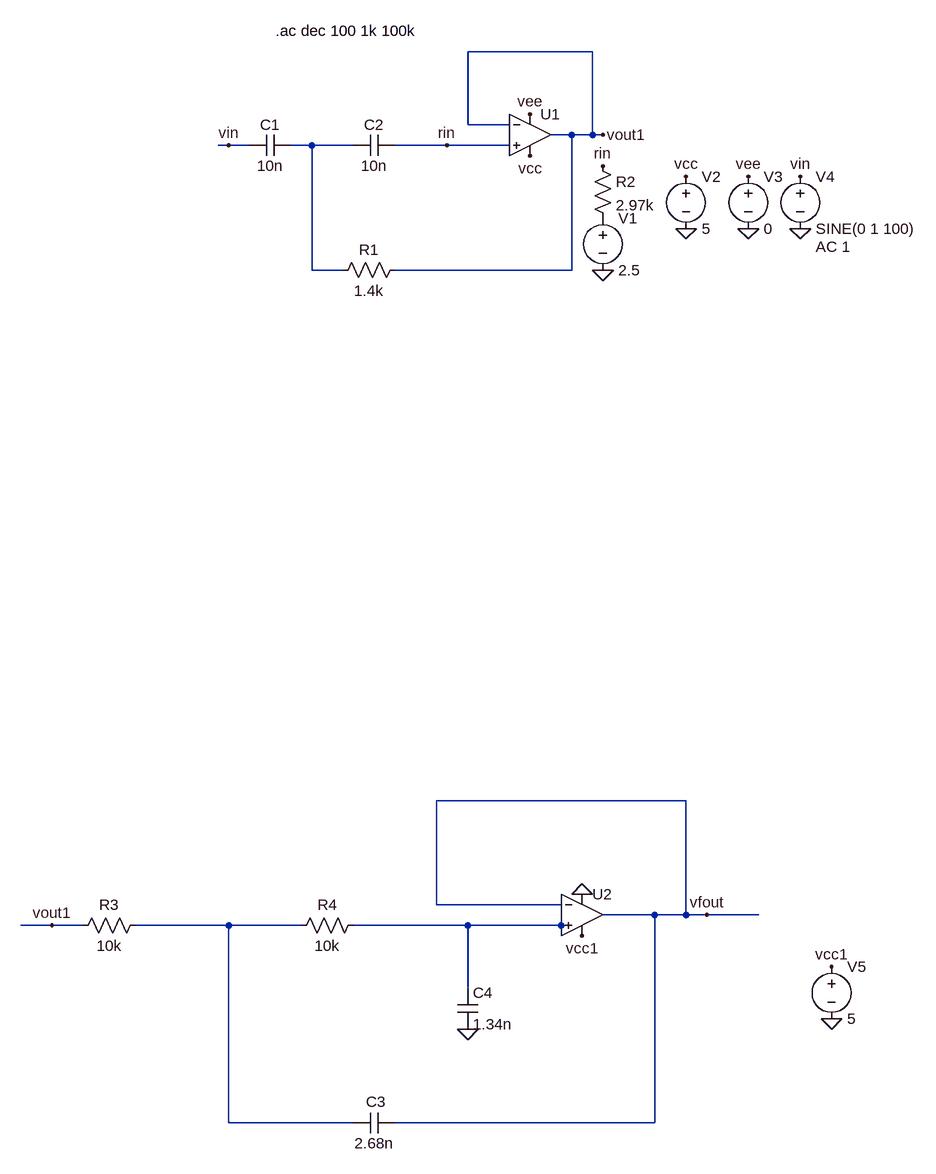
[diagram p0: schematic bpf_casc_8k_8.asc]
bpf_casc_8k_8.asc, the LTspice schematic file:
Version 4
SHEET 1 976 1664
WIRE 464 -32 272 -32
WIRE 272 80 272 -32
WIRE 336 80 272 80
WIRE 432 96 400 96
WIRE 464 96 464 -32
WIRE 464 96 432 96
WIRE 480 96 464 96
WIRE -96 112 -112 112
WIRE -64 112 -96 112
WIRE 32 112 0 112
WIRE 96 112 32 112
WIRE 240 112 160 112
WIRE 336 112 240 112
WIRE 32 304 32 112
WIRE 80 304 32 304
WIRE 432 304 432 96
WIRE 432 304 160 304
WIRE 608 1120 224 1120
WIRE 224 1280 224 1120
WIRE 416 1280 224 1280
WIRE 560 1296 480 1296
WIRE 608 1296 608 1120
WIRE 608 1296 560 1296
WIRE 640 1296 608 1296
WIRE 720 1296 640 1296
WIRE -368 1312 -416 1312
WIRE -320 1312 -368 1312
WIRE -96 1312 -240 1312
WIRE 16 1312 -96 1312
WIRE 272 1312 96 1312
WIRE 416 1312 272 1312
WIRE 432 1312 416 1312
WIRE 272 1408 272 1312
WIRE -96 1616 -96 1312
WIRE 96 1616 -96 1616
WIRE 560 1616 560 1296
WIRE 560 1616 160 1616
FLAG 480 304 0
FLAG 480 144 rin
FLAG 240 112 rin
FLAG 704 240 0
FLAG 608 240 0
FLAG 608 160 vcc
FLAG 704 160 vee
FLAG 368 64 vee
FLAG 368 128 vcc
FLAG 784 240 0
FLAG 784 160 vin
FLAG -96 112 vin
FLAG 480 96 vout1
FLAG 272 1472 0
FLAG 832 1456 0
FLAG 832 1376 vcc1
FLAG 448 1328 vcc1
FLAG 448 1264 0
FLAG 640 1296 vfout
FLAG -368 1312 vout1
SYMBOL cap 0 96 R90
WINDOW 0 0 32 VBottom 2
WINDOW 3 32 32 VTop 2
SYMATTR InstName C1
SYMATTR Value 10n
SYMBOL cap 160 96 R90
WINDOW 0 0 32 VBottom 2
WINDOW 3 32 32 VTop 2
SYMATTR InstName C2
SYMATTR Value 10n
SYMBOL res 176 288 R90
WINDOW 0 0 56 VBottom 2
WINDOW 3 32 56 VTop 2
SYMATTR InstName R1
SYMATTR Value 1.4k
SYMBOL OpAmps\\UniversalOpAmp 368 96 R0
SYMATTR InstName U1
SYMBOL res 464 128 R0
SYMATTR InstName R2
SYMATTR Value 2.97k
SYMBOL voltage 480 208 R0
WINDOW 123 0 0 Left 0
WINDOW 39 0 0 Left 0
SYMATTR InstName V1
SYMATTR Value 2.5
SYMBOL voltage 608 144 R0
WINDOW 123 0 0 Left 0
WINDOW 39 0 0 Left 0
SYMATTR InstName V2
SYMATTR Value 5
SYMBOL voltage 704 144 R0
WINDOW 123 0 0 Left 0
WINDOW 39 0 0 Left 0
SYMATTR InstName V3
SYMATTR Value 0
SYMBOL voltage 784 144 R0
WINDOW 123 24 124 Left 2
WINDOW 39 0 0 Left 0
SYMATTR InstName V4
SYMATTR Value SINE(0 1 100)
SYMATTR Value2 AC 1
SYMBOL res -224 1296 R90
WINDOW 0 0 56 VBottom 2
WINDOW 3 32 56 VTop 2
SYMATTR InstName R3
SYMATTR Value 10k
SYMBOL res 112 1296 R90
WINDOW 0 0 56 VBottom 2
WINDOW 3 32 56 VTop 2
SYMATTR InstName R4
SYMATTR Value 10k
SYMBOL OpAmps\\UniversalOpAmp 448 1296 R0
SYMATTR InstName U2
SYMBOL cap 160 1600 R90
WINDOW 0 -1 29 VBottom 2
WINDOW 3 32 32 VTop 2
SYMATTR InstName C3
SYMATTR Value 2.68n
SYMBOL cap 256 1408 R0
SYMATTR InstName C4
SYMATTR Value 1.34n
SYMBOL voltage 832 1360 R0
WINDOW 123 0 0 Left 0
WINDOW 39 0 0 Left 0
SYMATTR InstName V5
SYMATTR Value 5
TEXT -24 -64 Left 2 !.ac dec 100 1k 100k

The netlist it stands for:
* bpf_casc_8k_8.asc
C1 N001 vin 10n
C2 rin N001 10n
R1 vout1 N001 1.4k
XU1 rin vout1 vee vcc vout1 level1 Avol=1Meg GBW=10Meg Vos=0 En=0 Enk=0 In=0 Ink=0 Rin=500Meg  ; pins In+ In- V+ V- OUT
R2 rin P001 2.97k
V1 P001 0 2.5
V2 vcc 0 5
V3 vee 0 0
V4 vin 0 SINE(0 1 100) AC 1
R3 N002 vout1 10k
R4 N003 N002 10k
XU2 N003 vfout 0 vcc1 vfout level1 Avol=1Meg GBW=10Meg Vos=0 En=0 Enk=0 In=0 Ink=0 Rin=500Meg  ; pins In+ In- V+ V- OUT
C3 vfout N002 2.68n
C4 N003 0 1.34n
V5 vcc1 0 5
.ac dec 100 1k 100k
.lib UniversalOpAmp1.lib
.backanno
.end